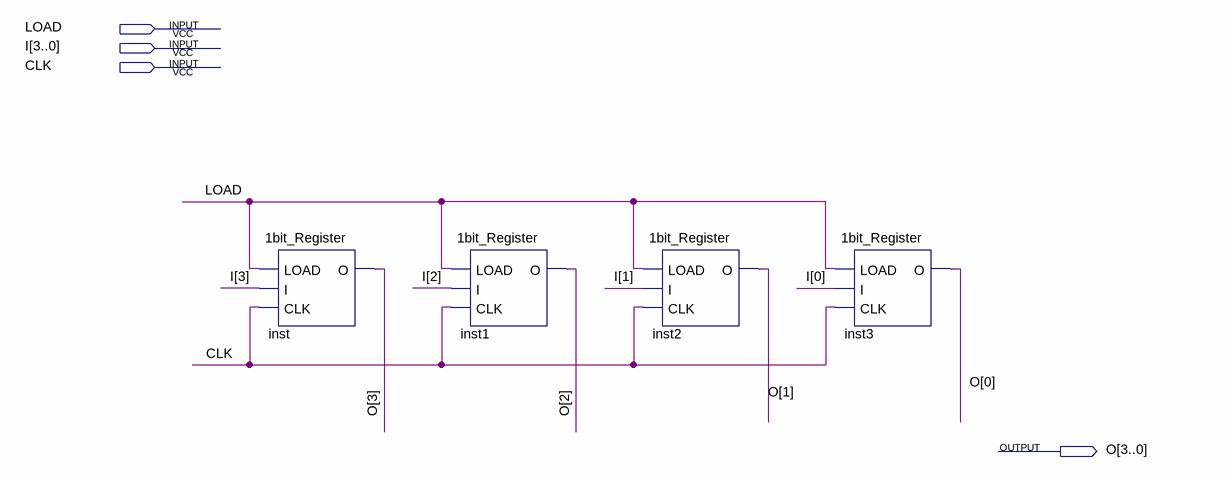
[diagram p0: schematic sheet]
// Quartus schematic 4bit_Register.bdf as structural Verilog: 4 symbols, 4 pins
module \4bit_Register  (
  input  LOAD,
  input  [3:0] I,
  input  CLK,
  output [3:0] O
);

  \1bit_Register  inst (.LOAD(LOAD), .I(I[3]), .CLK(CLK), .O(O[3]));
  \1bit_Register  inst1 (.LOAD(LOAD), .I(I[2]), .CLK(CLK), .O(O[2]));
  \1bit_Register  inst2 (.LOAD(LOAD), .I(I[1]), .CLK(CLK), .O(O[1]));
  \1bit_Register  inst3 (.LOAD(LOAD), .I(I[0]), .CLK(CLK), .O(O[0]));
endmodule
